# Altium schematic sheet PMIC_Block.SchDoc: RK3399 COB Design V1.0
size A3; Author: ABC; Organization: Altium Limited; Address1: L3, 12a Rodborough Rd; Address2: Frenchs Forest; Address3: NSW; Address4: Australia 2086; DocumentNumber: 12; SheetNumber: 12; SheetTotal: 27; PROJECT CODE: A_V1.0
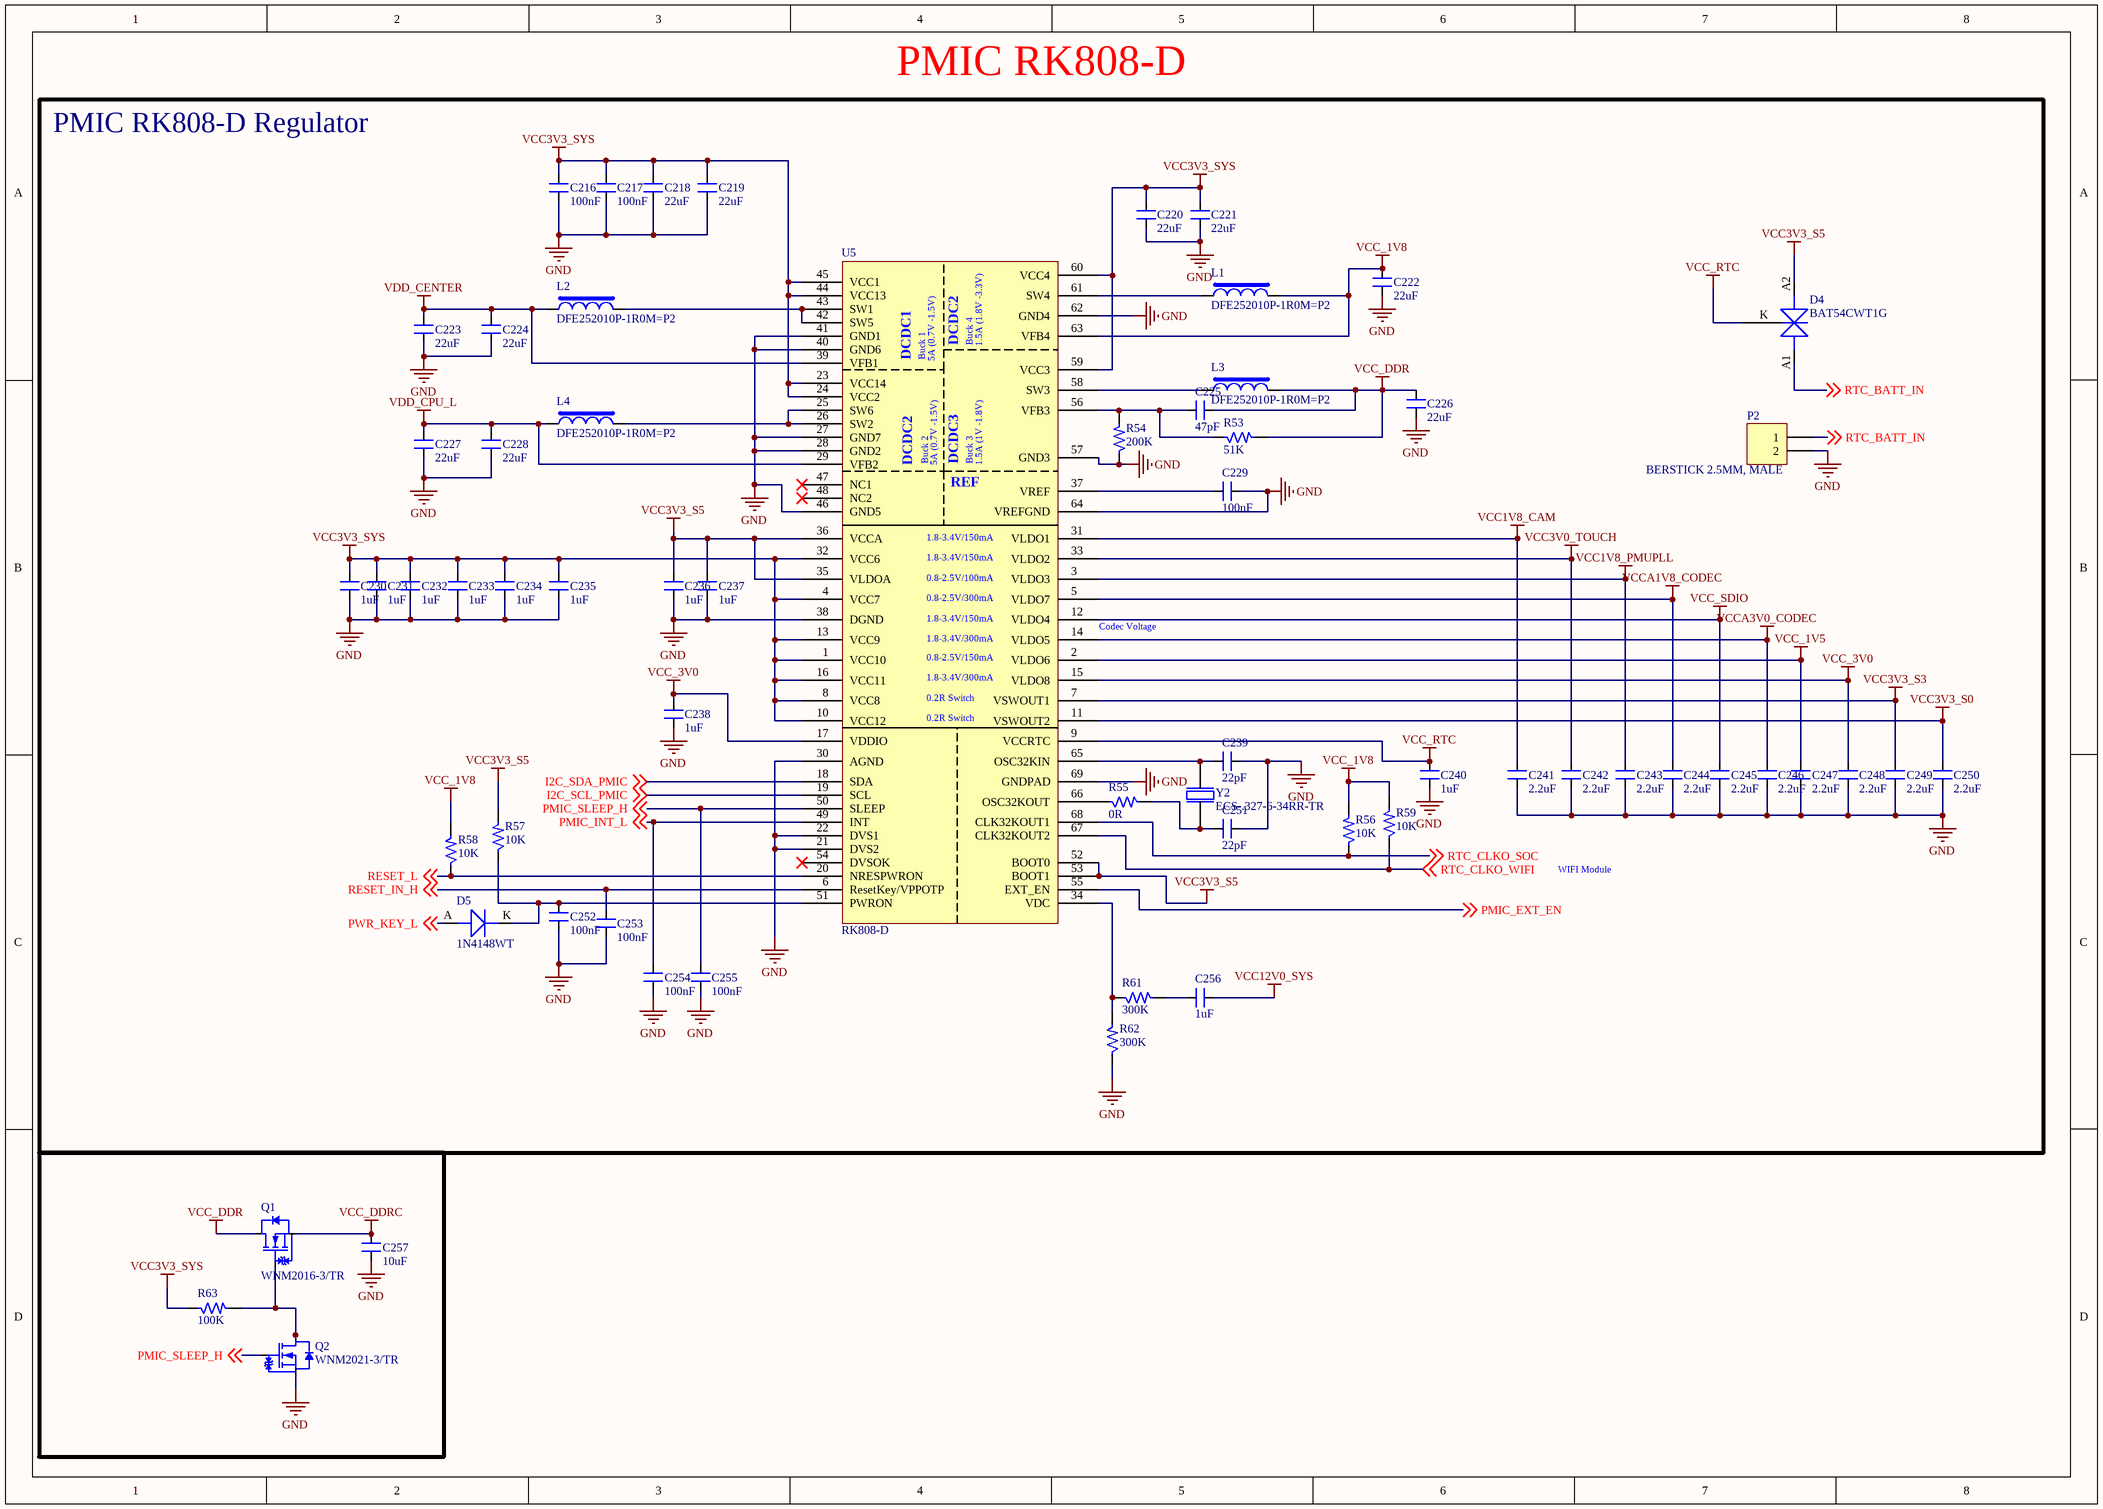
[diagram p0: PMIC_Block.SchDoc]

## Parts
C216  100nF  [CAP_0402]
C217  100nF  [CAP_0402]
C218  22uF  [CAP_0603]
C219  22uF  [CAP_0603]
C220  22uF  [CAP_0603]
C221  22uF  [CAP_0603]
C222  22uF  [CAP_0603]
C223  22uF  [CAP_0603]
C224  22uF  [CAP_0603]
C225  47pF  [CAP_0402]
C226  22uF  [CAP_0603]
C227  22uF  [CAP_0603]
C228  22uF  [CAP_0603]
C229  100nF  [CAP_0402]
C230  1uF  [CAP_0402]
C231  1uF  [CAP_0402]
C232  1uF  [CAP_0402]
C233  1uF  [CAP_0402]
C234  1uF  [CAP_0402]
C235  1uF  [CAP_0402]
C236  1uF  [CAP_0402]
C237  1uF  [CAP_0402]
C238  1uF  [CAP_0402]
C239  22pF  [CAP_0402]
C240  1uF  [CAP_0402]
C241  2.2uF  [CAP_0402]
C242  2.2uF  [CAP_0402]
C243  2.2uF  [CAP_0402]
C244  2.2uF  [CAP_0402]
C245  2.2uF  [CAP_0402]
C246  2.2uF  [CAP_0402]
C247  2.2uF  [CAP_0402]
C248  2.2uF  [CAP_0402]
C249  2.2uF  [CAP_0402]
C250  2.2uF  [CAP_0402]
C251  22pF  [CAP_0402]
C252  100nF  [CAP_0402]
C253  100nF  [CAP_0402]
C254  100nF  [CAP_0402]
C255  100nF  [CAP_0402]
C256  1uF  [CAP_0402]
C257  10uF  [CAP_0402]
D4  BAT54CWT1G  [DIO_SOT-323-3]
D5  1N4148WT  [DIO_SOD523]
L1  DFE252010P-1R0M=P2  [IND_1008]
L2  DFE252010P-1R0M=P2  [IND_1008]
L3  DFE252010P-1R0M=P2  [IND_1008]
L4  DFE252010P-1R0M=P2  [IND_1008]
P2  BERSTICK 2.5MM, MALE  [CON2_100_43D62_TH_ST]
Q1  WNM2016-3/TR  [SOT 23-3]
Q2  WNM2021-3/TR  [SOT-323-3]
R53  51K  [RES_0402]
R54  200K  [RES_0402]
R55  0R  [RES_0402]
R56  10K  [RES_0402]
R57  10K  [RES_0402]
R58  10K  [RES_0402]
R59  10K  [RES_0402]
R61  300K  [RES_0402]
R62  300K  [RES_0402]
R63  100K  [RES_0402]
U5  RK808-D  [QFN68_13.7_220.4X220.4_SMD]
Y2  ECS-.327-6-34RR-TR  [XTAL_ECS-.327-6-34RR-TR]

## Blocks framed on the sheet
PMIC RK808-D: C216-C256 D4 D5 L1-L4 P2 R53-R59 R61 R62 U5 Y2

## Nets
GND: C216.1 C217.1 C218.1 C219.1 C220.1 C221.1 C222.1 C223.1 C224.1 C226.1 C227.1 C228.1 C229.1 C230.2 C231.1 C232.1 C233.1 C234.1 C235.1 C236.1 C237.1 C238.1 C239.2 C240.1 C241.1 C242.1 C243.1 C244.1 C245.1 C246.1 C247.1 C248.1 C249.1 C250.1 C251.2 C252.1 C253.1 C254.1 C255.1 C257.1 P2.2 Q2.2(S) R54.1 R62.1 U5.21(DVS2) U5.22(DVS1) U5.27(GND7) U5.28(GND2) U5.30(AGND) U5.38(DGND) U5.40(GND6) U5.41(GND1) U5.46(GND5) U5.57(GND3) U5.62(GND4) U5.64(VREFGND) U5.69(GNDPAD)
VCC1V8_CAM: C241.2 U5.31(VLDO1)
VCC1V8_PMUPLL: C243.2 U5.3(VLDO3)
VCC3V0_TOUCH: C242.2 U5.33(VLDO2)
VCC3V3_S0: C250.2 U5.11(VSWOUT2)
VCC3V3_S3: C249.2 U5.7(VSWOUT1)
VCC3V3_S5: C236.2 C237.2 D4.A2 R57.2 U5.35(VLDOA) U5.36(VCCA) U5.52(BOOT0) U5.53(BOOT1)
VCC3V3_SYS: C216.2 C217.2 C218.2 C219.2 C220.2 C221.2 C230.1 C231.2 C232.2 C233.2 C234.2 C235.2 R63.1 U5.1(VCC10) U5.4(VCC7) U5.8(VCC8) U5.10(VCC12) U5.13(VCC9) U5.16(VCC11) U5.23(VCC14) U5.24(VCC2) U5.32(VCC6) U5.44(VCC13) U5.45(VCC1) U5.59(VCC3) U5.60(VCC4)
VCC12V0_SYS: C256.1
VCC_1V5: C247.2 U5.2(VLDO6)
VCC_1V8: C222.2 L1.2 R56.2 R58.2 R59.2 U5.63(VFB4)
VCC_3V0: C238.2 C248.2 U5.15(VLDO8) U5.17(VDDIO)
VCC_DDR: C225.2 C226.2 L3.2 Q1.3(D) R53.2
VCC_DDRC: C257.2 Q1.2(S)
VCC_RTC: C240.2 D4.K U5.9(VCCRTC)
VCC_SDIO: C245.2 U5.12(VLDO4)
VCCA1V8_CODEC: C244.2 U5.5(VLDO7)
VCCA3V0_CODEC: C246.2 U5.14(VLDO5)
VDD_CENTER: C223.2 C224.2 L2.1 U5.39(VFB1)
VDD_CPU_L: C227.2 C228.2 L4.1 U5.29(VFB2)
I2C_SCL_PMIC: U5.19(SCL) ; off-sheet I2C_SCL_PMIC
I2C_SDA_PMIC: U5.18(SDA) ; off-sheet I2C_SDA_PMIC
PMIC_EXT_EN: U5.55(EXT_EN) ; off-sheet PMIC_EXT_EN
PMIC_INT_L: C254.2 U5.49(INT) ; off-sheet PMIC_INT_L
PMIC_SLEEP_H: C255.2 Q2.1(G) U5.50(SLEEP) ; off-sheet PMIC_SLEEP_H
PWR_KEY_L: D5.A(ANODE) ; off-sheet PWR_KEY_L
RESET_IN_H: C253.2 U5.6(ResetKey/VPPOTP) ; off-sheet RESET_IN_H
RESET_L: R58.1 U5.20(NRESPWRON) ; off-sheet RESET_L
RTC_BATT_IN: D4.A1 P2.1 ; off-sheet RTC_BATT_IN
RTC_CLKO_SOC: R56.1 U5.68(CLK32KOUT1) ; off-sheet RTC_CLKO_SOC
RTC_CLKO_WIFI: R59.1 U5.67(CLK32KOUT2) ; off-sheet RTC_CLKO_WIFI
NetC225_1: C225.1 R53.1 R54.2 U5.56(VFB3)
NetC229_2: C229.2 U5.37(VREF)
NetC239_1: C239.1 U5.65(OSC32KIN) Y2.2
NetC251_1: C251.1 R55.2 Y2.1
NetC252_2: C252.2 D5.K(CATHODE) R57.1 U5.51(PWRON)
NetC256_2: C256.2 R61.2
NetL1_1: L1.1 U5.61(SW4)
NetL2_2: L2.2 U5.42(SW5) U5.43(SW1)
NetL3_1: L3.1 U5.58(SW3)
NetL4_2: L4.2 U5.25(SW6) U5.26(SW2)
NetQ1_1: Q1.1(G) Q2.3(D) R63.2
NetR55_1: R55.1 U5.66(OSC32KOUT)
NetR61_1: R61.1 R62.2 U5.34(VDC)

Not connected (* = marked no-connect by the designer): U5 47(NC1)* 48(NC2)* 54(DVSOK)*

## Notes on the sheet
- PMIC RK808-D Regulator
- (near U5) Codec Voltage
- WIFI Module
- TITLE:
- DOCUMENT NAME:
- SCALE 1:1
- This document is copyright of Esteempcb and shall not be revealed, produced, copied, in whole or in part, nor
- PROJECT CODE:
- TEMPLATE:
- A3
- AUTHOR:
- Sheet
- of
- used for any purpose other than submitted.
- (in symbol IC_RK808-D-QFN68) DCDC2; Buck 4; 1.5A (1.8V -3.3V); DCDC1; Buck 1; 5A (0.7V -1.5V); Buck 2; DCDC3; Buck 3; 1.5A (1V -1.8V); REF; 1.8-3.4V/150mA; 0.8-2.5V/100mA; 0.8-2.5V/300mA; 1.8-3.4V/300mA; 0.8-2.5V/150mA; 0.2R Switch

## Library data of the parts
C216 C217 C229 C252-C255 = CAP_100nF-25V-10%-0402: 0.1µF ±10% 25V Ceramic Capacitor X7R 0402 (1005 Metric) /; Manufacturer: Walsin Technology Corporation; Manufacturer Part Number: 0402B104K250CT; Case/Package: 0402; Supplier-1: Digikey
C218-C224 C226-C228 = CAP_22uF-10V-20%-0603: 22µF ±20% 10V Ceramic Capacitor X5R 0603 (1608 Metric) /; Manufacturer: Murata Electronics; Manufacturer Part Number: GRM188R61A226ME15D; Case/Package: 0603; Supplier-1: Digikey
C225 = CAP_47pF-10V-10%-0402: 47pF ±10% 10V Ceramic Capacitor C0G, NP0 0402 (1005 Metric) /; Manufacturer: KEMET; Manufacturer Part Number: C0402C470K8GAC7867; Case/Package: 0402; Supplier-1: Supplier-1
C230-C238 C240 C256 = CAP_1uF-16V-10%-0402: 1µF ±10% 16V Ceramic Capacitor X5R 0402 (1005 Metric) /; Manufacturer: Knowles Novacap; Manufacturer Part Number: 0402BW105K160YT; Case/Package: 0402; Supplier-1: Digikey
C239 C251 = CAP_22pF-10V-10%-0402: 22pF ±10% 10V Ceramic Capacitor C0G, NP0 0402 (1005 Metric) /; Manufacturer: KEMET; Manufacturer Part Number: C0402C220K8GACTU; Case/Package: 0402; Supplier-1: Digikey
C241-C250 = CAP_2.2uF-10V-10%-0402: 2.2µF ±10% 10V Ceramic Capacitor X5R 0402 (1005 Metric) /; Manufacturer: Murata Electronics; Manufacturer Part Number: GRM155R61A225KE95D; Case/Package: 0402; Supplier-1: Digikey
C257 = CAP_10uF-10V-20%-0402: 10µF ±20% 10V Ceramic Capacitor X5R 0402 (1005 Metric) /; Manufacturer Part Number: CL05A106MP5NUNC; Manufacturer: Samsung Electro-Mechanics; Case/Package: 0402; Supplier-1: Digikey
D4 = DIO-S-A_30V-200mA-SOT-323: Diode Array 1 Pair Common Cathode Schottky 30V 200mA (DC) Surface Mount SC-70, SOT-323; Manufacturer: ON Semiconductor; Manufacturer Part Number: BAT54CWT1G; Case/Package: SOT323; Supplier-1: Digikey
D5 = DIO_75V-200mA-SOD-523F: Diode Standard 100V 300mA (DC) Surface Mount SOD-123; Manufacturer: FAIRCHILD; Manufacturer Part Number: 1N4148WT; Case/Package: SOD123; Supplier-1: SIRICOM
L1-L4 = IND_1uH-3.8A-20%-1008: 1µH Shielded Wirewound Inductor 3.8A 54mOhm Max 1008 (2520 Metric) /; Manufacturer: Murata Electronics; Manufacturer Part Number: DFE252010P-1R0M=P2; Case/Package: 1008; Supplier-1: Digikey
P2 = CON-BS-PLG_2X1-100-ST-TH: 2 Pins, 1 Row 2.54mm Pitch, Straight bergstrip, Male; Manufacturer Part Number: NA; Manufacturer: Samtec; Case/Package: TH-CON; Supplier-1: SP ROAD
Q1 = MOSFET-N_20V-2.9A-SOT-23: N Channel 20V 2.9A 1V @ 250uA 47mΩ @ 3.6A,4.5V 700mW SOT-23(SOT-23-3) MOSFET RoHS /; Manufacturer: WILLSEMI(Will Semicon); Manufacturer Part Number: WNM2016-3/TR; Case/Package: SOT-23(SOT-23-3); Supplier-1: LCSC
Q2 = MOSFET-N_20V-820mA-SOT-323: N Channel 20V 820mA 850mV @ 250uA 310mΩ @ 550mA,4.5V 310mW SOT-323(SC-70) MOSFET RoHS /; Manufacturer: WILLSEMI(Will Semicon); Manufacturer Part Number: WNM2021-3/TR; Case/Package: SOT-323(SC-70); Supplier-1: LCSC
R53 = RES_51K-0.1W-1%-0402: 51 kOhms ±1% 0.1W, 1/10W Chip Resistor 0402 (1005 Metric) Automotive AEC-Q200 Thick Film /; Manufacturer: Panasonic Electronic Components; Manufacturer Part Number: ERJ-2RKF5102X; Case/Package: 0402; Supplier-1: Digikey
R54 = RES_200K-0.1W-1%-0402: 200 kOhms ±1% 0.1W, 1/10W Chip Resistor 0402 (1005 Metric) Automotive AEC-Q200 Thick Film /; Manufacturer: Panasonic Electronic Components; Manufacturer Part number: ERJ-2RKF2003X; Case/Package: 0402; Supplier-1: Digikey
R55 = RES_0R-0.1W-1%-0402: 0 Ohms Jumper 0.1W, 1/10W Chip Resistor 0402 (1005 Metric) Automotive AEC-Q200 Thick Film; Manufacturer: Panasonic Electronic Components; Manufacturer Part Number: ERJ-2GE0R00X; Case/Package: 0402; Supplier-1: Digikey
R56-R59 = RES_10K-0.1W-1%-0402: 10 kOhms ±1% 0.1W, 1/10W Chip Resistor 0402 (1005 Metric) Anti-Sulfur Thin Film /; Manufacturer: Vishay Beyschlag/Draloric/BC Components; Manufacturer Part Number: MCS04020C1002FE000; Case/Package: 0402; Supplier-1: Digikey
R61 R62 = RES_300K-0.1W-1%-0402: 300 kOhms ±1% 0.1W, 1/10W Chip Resistor 0402 (1005 Metric) Automotive AEC-Q200 Thick Film /; Manufacturer: Panasonic Electronic Components; Manufacturer Part Number: ERJ-2RKF3003X; Case/Package: 0402; Supplier-1: Digikey
R63 = RES_100K-0.1W-1%-0402: 100 kOhms ±1% 0.1W, 1/10W Chip Resistor 0402 (1005 Metric) Anti-Sulfur Thin Film /; Manufacturer: Vishay Beyschlag/Draloric/BC Components; Manufacturer Part Number: MCS04020C1003FE000; Case/Package: 0402; Supplier-1: Digikey
U5 = IC_RK808-D-QFN68: The RK808 is a complete power supply solution for Portable systems.; Manufacturer: Rockchip; Manufacturer Part Number: RK808-D; Case/Package: QFN68; Supplier-1: Rockchip
Y2 = XTAL_32.768Khz-22pF-SMD: 32.768kHz ±20ppm Crystal 12pF 80 kOhms 2-SMD, No Lead /; Manufacturer: Ecliptek; Manufacturer Part Number: ECS-.327-6-34RR-TR; Case/Package: 0603; Supplier-1: Digikey